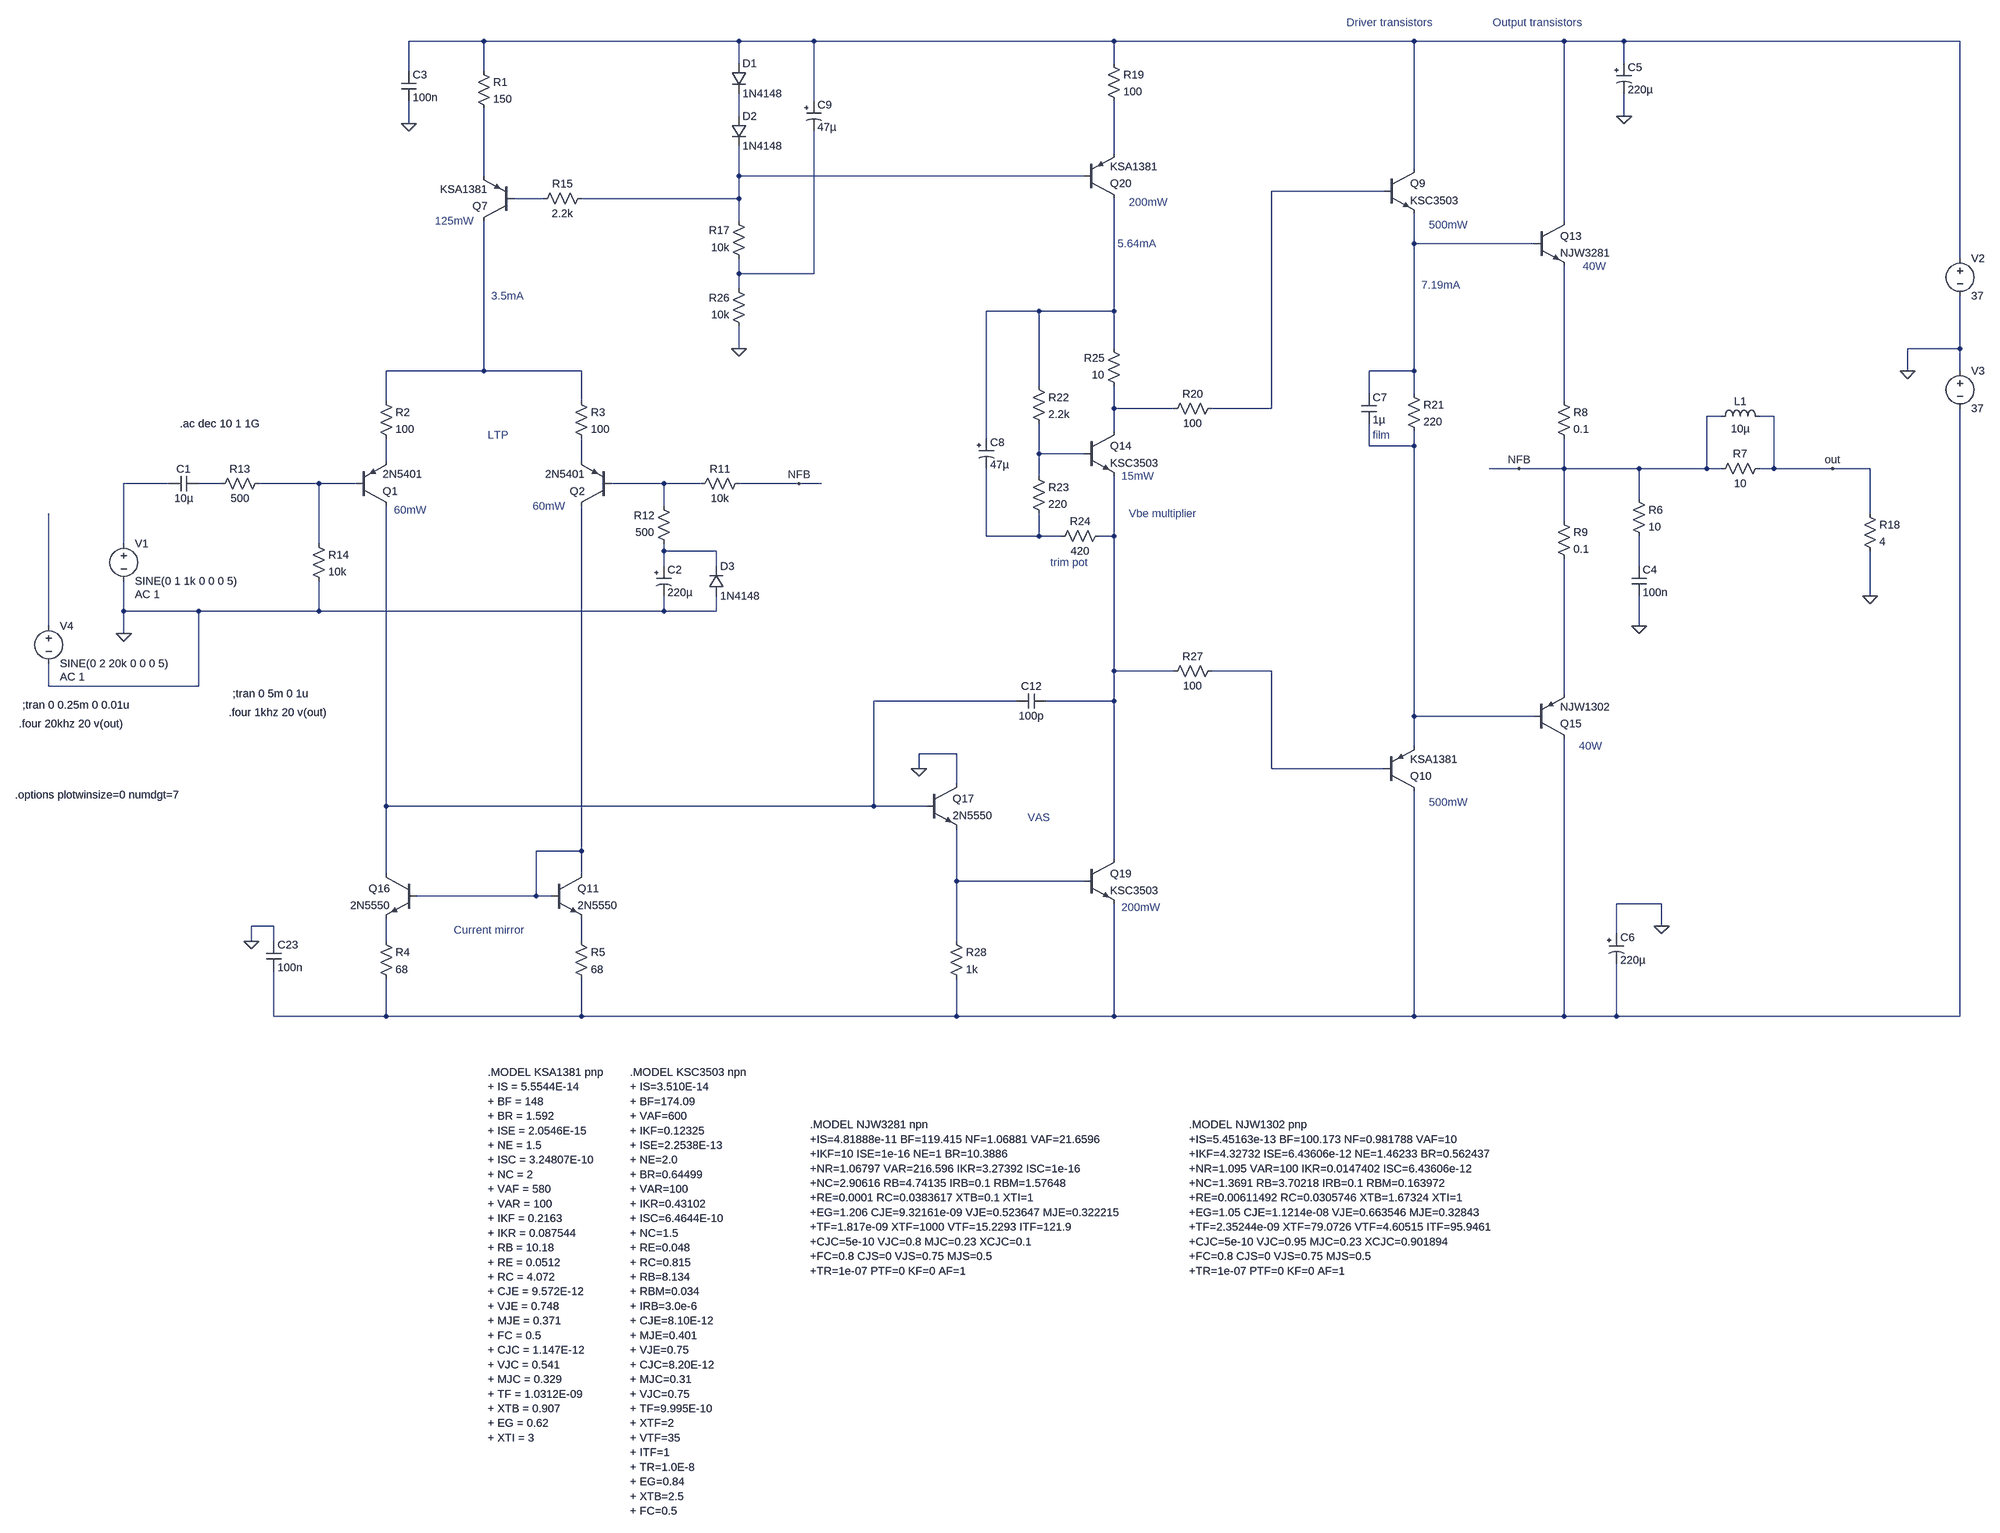
[diagram p0: schematic blameless-v1.asc]
blameless-v1.asc, the LTspice schematic file:
Version 4
SHEET 1 3556 2568
WIRE -32 -832 -192 -832
WIRE 512 -832 -32 -832
WIRE 672 -832 512 -832
WIRE 1312 -832 672 -832
WIRE 1952 -832 1312 -832
WIRE 2272 -832 1952 -832
WIRE 2400 -832 2272 -832
WIRE 3120 -832 2400 -832
WIRE 512 -784 512 -832
WIRE 1312 -784 1312 -832
WIRE 2400 -784 2400 -832
WIRE -192 -768 -192 -832
WIRE -32 -768 -32 -832
WIRE 672 -704 672 -832
WIRE 512 -672 512 -720
WIRE 2400 -672 2400 -720
WIRE -192 -656 -192 -704
WIRE 1312 -592 1312 -704
WIRE 1952 -560 1952 -832
WIRE -32 -544 -32 -688
WIRE 512 -544 512 -608
WIRE 1248 -544 512 -544
WIRE 1888 -512 1648 -512
WIRE 96 -496 32 -496
WIRE 512 -496 512 -544
WIRE 512 -496 176 -496
WIRE 512 -448 512 -496
WIRE 2272 -448 2272 -832
WIRE 1952 -400 1952 -464
WIRE 2208 -400 1952 -400
WIRE 3120 -368 3120 -832
WIRE 512 -336 512 -368
WIRE 672 -336 672 -640
WIRE 672 -336 512 -336
WIRE 512 -304 512 -336
WIRE 1152 -256 1040 -256
WIRE 1312 -256 1312 -496
WIRE 1312 -256 1152 -256
WIRE 512 -176 512 -224
WIRE 1312 -176 1312 -256
WIRE 3120 -176 3120 -288
WIRE 3120 -176 3008 -176
WIRE -32 -128 -32 -448
WIRE -32 -128 -240 -128
WIRE 176 -128 -32 -128
WIRE 1952 -128 1952 -400
WIRE 1952 -128 1856 -128
WIRE 3008 -128 3008 -176
WIRE 3120 -128 3120 -176
WIRE 1152 -96 1152 -256
WIRE 1856 -80 1856 -128
WIRE 1952 -80 1952 -128
WIRE -240 -64 -240 -128
WIRE 176 -64 176 -128
WIRE 2272 -64 2272 -352
WIRE 1312 -48 1312 -96
WIRE 1440 -48 1312 -48
WIRE 1648 -48 1648 -512
WIRE 1648 -48 1520 -48
WIRE 2608 -32 2576 -32
WIRE 2720 -32 2688 -32
WIRE 1312 0 1312 -48
WIRE 1040 16 1040 -256
WIRE 1856 32 1856 -16
WIRE 1952 32 1952 0
WIRE 1952 32 1856 32
WIRE 1152 48 1152 -16
WIRE 1248 48 1152 48
WIRE -240 64 -240 16
WIRE 176 64 176 16
WIRE 2176 80 2112 80
WIRE 2272 80 2272 16
WIRE 2272 80 2176 80
WIRE 2432 80 2272 80
WIRE 2576 80 2576 -32
WIRE 2576 80 2432 80
WIRE 2608 80 2576 80
WIRE 2720 80 2720 -32
WIRE 2720 80 2688 80
WIRE 2848 80 2720 80
WIRE 2928 80 2848 80
WIRE 1152 96 1152 48
WIRE -704 112 -800 112
WIRE -592 112 -640 112
WIRE -384 112 -512 112
WIRE -304 112 -384 112
WIRE 352 112 240 112
WIRE 432 112 352 112
WIRE 640 112 512 112
WIRE 688 112 640 112
WIRE 2432 144 2432 80
WIRE 352 160 352 112
WIRE 2928 176 2928 80
WIRE 2272 192 2272 80
WIRE 1040 224 1040 80
WIRE 1152 224 1152 176
WIRE 1152 224 1040 224
WIRE 1200 224 1152 224
WIRE 1312 224 1312 96
WIRE 1312 224 1280 224
WIRE -800 240 -800 112
WIRE -384 240 -384 112
WIRE 352 256 352 240
WIRE 464 256 352 256
WIRE 352 288 352 256
WIRE 464 288 464 256
WIRE 2432 288 2432 224
WIRE 2928 352 2928 256
WIRE -800 384 -800 320
WIRE -640 384 -800 384
WIRE -384 384 -384 320
WIRE -384 384 -640 384
WIRE 352 384 352 352
WIRE 352 384 -384 384
WIRE 464 384 464 352
WIRE 464 384 352 384
WIRE -960 416 -960 176
WIRE 2432 416 2432 352
WIRE -800 432 -800 384
WIRE 1312 512 1312 224
WIRE 1440 512 1312 512
WIRE 1648 512 1520 512
WIRE -960 544 -960 496
WIRE -640 544 -640 384
WIRE -640 544 -960 544
WIRE 2272 560 2272 272
WIRE 1104 576 800 576
WIRE 1312 576 1312 512
WIRE 1312 576 1168 576
WIRE 1952 608 1952 32
WIRE 2208 608 1952 608
WIRE 1952 672 1952 608
WIRE 976 688 896 688
WIRE 896 720 896 688
WIRE 1648 720 1648 512
WIRE 1888 720 1648 720
WIRE 976 752 976 688
WIRE -240 800 -240 160
WIRE 800 800 800 576
WIRE 800 800 -240 800
WIRE 912 800 800 800
WIRE 176 896 176 160
WIRE 176 896 80 896
WIRE 1312 912 1312 576
WIRE -240 944 -240 800
WIRE 176 944 176 896
WIRE 976 960 976 848
WIRE 1248 960 976 960
WIRE 80 992 80 896
WIRE 80 992 -176 992
WIRE 112 992 80 992
WIRE 2480 1008 2384 1008
WIRE -480 1056 -528 1056
WIRE 2480 1056 2480 1008
WIRE 2384 1072 2384 1008
WIRE -528 1088 -528 1056
WIRE -480 1088 -480 1056
WIRE -240 1088 -240 1040
WIRE 176 1088 176 1040
WIRE 976 1088 976 960
WIRE -480 1248 -480 1152
WIRE -240 1248 -240 1168
WIRE -240 1248 -480 1248
WIRE 176 1248 176 1168
WIRE 176 1248 -240 1248
WIRE 976 1248 976 1168
WIRE 976 1248 176 1248
WIRE 1312 1248 1312 1008
WIRE 1312 1248 976 1248
WIRE 1952 1248 1952 768
WIRE 1952 1248 1312 1248
WIRE 2272 1248 2272 656
WIRE 2272 1248 1952 1248
WIRE 2384 1248 2384 1136
WIRE 2384 1248 2272 1248
WIRE 3120 1248 3120 -48
WIRE 3120 1248 2384 1248
FLAG -800 432 0
FLAG 2928 352 0
FLAG 3008 -128 0
FLAG 2848 80 out
FLAG 2176 80 NFB
FLAG 640 112 NFB
FLAG 896 720 0
FLAG -528 1088 0
FLAG 512 -176 0
FLAG -192 -656 0
FLAG 2432 416 0
FLAG 2400 -672 0
FLAG 2480 1056 0
DATAFLAG 2528 1248 ""
DATAFLAG 1312 416 ""
DATAFLAG 1216 -256 ""
DATAFLAG 2496 80 ""
DATAFLAG 2480 -832 ""
SYMBOL pnp 240 160 R180
SYMATTR InstName Q2
SYMATTR Value 2N5401
SYMBOL pnp -304 160 M180
SYMATTR InstName Q1
SYMATTR Value 2N5401
SYMBOL res -48 -784 R0
SYMATTR InstName R1
SYMATTR Value 150
SYMBOL res -256 -80 R0
SYMATTR InstName R2
SYMATTR Value 100
SYMBOL res 160 -80 R0
SYMATTR InstName R3
SYMATTR Value 100
SYMBOL res -256 1072 R0
SYMATTR InstName R4
SYMATTR Value 68
SYMBOL res 160 1072 R0
SYMATTR InstName R5
SYMATTR Value 68
SYMBOL res 528 96 R90
WINDOW 0 0 56 VBottom 2
WINDOW 3 32 56 VTop 2
SYMATTR InstName R11
SYMATTR Value 10k
SYMBOL res 368 256 R180
WINDOW 0 36 76 Left 2
WINDOW 3 36 40 Left 2
SYMATTR InstName R12
SYMATTR Value 500
SYMBOL res -608 128 R270
WINDOW 0 32 56 VTop 2
WINDOW 3 0 56 VBottom 2
SYMATTR InstName R13
SYMATTR Value 500
SYMBOL res -400 224 R0
SYMATTR InstName R14
SYMATTR Value 10k
SYMBOL res 2912 160 R0
SYMATTR InstName R18
SYMATTR Value 4
SYMBOL cap -640 96 R90
WINDOW 0 0 32 VBottom 2
WINDOW 3 32 32 VTop 2
SYMATTR InstName C1
SYMATTR Value 10µ
SYMBOL voltage -800 224 R0
WINDOW 123 24 124 Left 2
WINDOW 39 0 0 Left 0
SYMATTR Value2 AC 1
SYMATTR InstName V1
SYMATTR Value SINE(0 1 1k 0 0 0 5)
SYMBOL voltage 3120 -384 R0
WINDOW 123 0 0 Left 0
WINDOW 39 24 44 Left 2
SYMATTR InstName V2
SYMATTR Value 37
SYMBOL voltage 3120 -144 R0
WINDOW 123 0 0 Left 0
WINDOW 39 24 44 Left 2
SYMATTR InstName V3
SYMATTR Value 37
SYMBOL npn 1888 -560 R0
SYMATTR InstName Q9
SYMATTR Value KSC3503
SYMBOL npn 2208 -448 R0
SYMATTR InstName Q13
SYMATTR Value NJW3281
SYMBOL pnp 2208 656 M180
SYMATTR InstName Q15
SYMATTR Value NJW1302
SYMBOL pnp 1888 768 M180
SYMATTR InstName Q10
SYMATTR Value KSA1381
SYMBOL res 2256 -80 R0
SYMATTR InstName R8
SYMATTR Value 0.1
SYMBOL res 2256 176 R0
SYMATTR InstName R9
SYMATTR Value 0.1
SYMBOL res 1936 -96 R0
SYMATTR InstName R21
SYMATTR Value 220
SYMBOL npn 1248 0 R0
SYMATTR InstName Q14
SYMATTR Value KSC3503
SYMBOL res 1136 -112 R0
SYMATTR InstName R22
SYMATTR Value 2.2k
SYMBOL res 1136 80 R0
SYMATTR InstName R23
SYMATTR Value 220
SYMBOL res 1296 208 R90
WINDOW 0 0 56 VBottom 2
WINDOW 3 32 56 VTop 2
SYMATTR InstName R24
SYMATTR Value 420
SYMBOL npn 112 944 R0
SYMATTR InstName Q11
SYMATTR Value 2N5550
SYMBOL npn -176 944 M0
SYMATTR InstName Q16
SYMATTR Value 2N5550
SYMBOL npn 912 752 R0
SYMATTR InstName Q17
SYMATTR Value 2N5550
SYMBOL npn 1248 912 R0
SYMATTR InstName Q19
SYMATTR Value KSC3503
SYMBOL res 1296 -800 R0
SYMATTR InstName R19
SYMATTR Value 100
SYMBOL res 960 1072 R0
SYMATTR InstName R28
SYMATTR Value 1k
SYMBOL cap 1840 -80 R0
SYMATTR InstName C7
SYMATTR Value 1µ
SYMATTR SpiceLine V=310 Irms=0 Rser=0.027 Lser=13.6n
SYMBOL polcap 1024 16 R0
WINDOW 3 24 56 Left 2
SYMATTR Value 47µ
SYMATTR InstName C8
SYMATTR Description Capacitor
SYMATTR Type cap
SYMATTR SpiceLine V=35 Irms=190m Rser=0.5 Lser=0
SYMBOL polcap 656 -704 R0
WINDOW 3 24 56 Left 2
SYMATTR Value 47µ
SYMATTR InstName C9
SYMATTR Description Capacitor
SYMATTR Type cap
SYMATTR SpiceLine V=35 Irms=190m Rser=0.5 Lser=0
SYMBOL pnp 1248 -496 M180
SYMATTR InstName Q20
SYMATTR Value KSA1381
SYMBOL cap 1168 592 M270
WINDOW 0 32 32 VTop 2
WINDOW 3 0 32 VBottom 2
SYMATTR InstName C12
SYMATTR Value 100p
SYMBOL res 1328 -80 R180
WINDOW 0 36 76 Left 2
WINDOW 3 36 40 Left 2
SYMATTR InstName R25
SYMATTR Value 10
SYMBOL cap -496 1088 R0
SYMATTR InstName C23
SYMATTR Value 100n
SYMATTR SpiceLine V=25 Irms=2.1 Rser=0.0606238 Lser=0 mfg="KEMET" pn="C1210C104K3RAC" type="X7R"
SYMBOL voltage -960 400 R0
WINDOW 123 24 124 Left 2
WINDOW 39 0 0 Left 0
SYMATTR Value2 AC 1
SYMATTR InstName V4
SYMATTR Value SINE(0 2 20k 0 0 0 5)
SYMBOL pnp 32 -448 R180
SYMATTR InstName Q7
SYMATTR Value KSA1381
SYMBOL res 192 -512 R90
WINDOW 0 0 56 VBottom 2
WINDOW 3 32 56 VTop 2
SYMATTR InstName R15
SYMATTR Value 2.2k
SYMBOL res 528 -352 R180
WINDOW 0 36 76 Left 2
WINDOW 3 36 40 Left 2
SYMATTR InstName R17
SYMATTR Value 10k
SYMBOL res 528 -208 R180
WINDOW 0 36 76 Left 2
WINDOW 3 36 40 Left 2
SYMATTR InstName R26
SYMATTR Value 10k
SYMBOL diode 496 -784 R0
SYMATTR InstName D1
SYMATTR Value 1N4148
SYMBOL diode 496 -672 R0
SYMATTR InstName D2
SYMATTR Value 1N4148
SYMBOL polcap 336 288 R0
WINDOW 3 24 56 Left 2
SYMATTR Value 220µ
SYMATTR InstName C2
SYMATTR Description Capacitor
SYMATTR Type cap
SYMATTR SpiceLine V=35 Irms=190m Rser=0.5 Lser=0
SYMBOL diode 448 352 M180
WINDOW 0 24 64 Left 2
WINDOW 3 24 0 Left 2
SYMATTR InstName D3
SYMATTR Value 1N4148
SYMBOL res 1536 -64 R90
WINDOW 0 0 56 VBottom 2
WINDOW 3 32 56 VTop 2
SYMATTR InstName R20
SYMATTR Value 100
SYMBOL res 1536 496 R90
WINDOW 0 0 56 VBottom 2
WINDOW 3 32 56 VTop 2
SYMATTR InstName R27
SYMATTR Value 100
SYMBOL cap -208 -768 R0
SYMATTR InstName C3
SYMATTR Value 100n
SYMATTR SpiceLine V=25 Irms=2.1 Rser=0.0606238 Lser=0 mfg="KEMET" pn="C1210C104K3RAC" type="X7R"
SYMBOL res 2416 128 R0
SYMATTR InstName R6
SYMATTR Value 10
SYMBOL cap 2416 288 R0
SYMATTR InstName C4
SYMATTR Value 100n
SYMBOL res 2704 64 R90
WINDOW 0 0 56 VBottom 2
WINDOW 3 32 56 VTop 2
SYMATTR InstName R7
SYMATTR Value 10
SYMBOL ind 2592 -16 R270
WINDOW 0 32 56 VTop 2
WINDOW 3 5 56 VBottom 2
SYMATTR InstName L1
SYMATTR Value 10µ
SYMBOL polcap 2384 -784 R0
WINDOW 3 24 56 Left 2
SYMATTR Value 220µ
SYMATTR InstName C5
SYMATTR Description Capacitor
SYMATTR Type cap
SYMATTR SpiceLine V=35 Irms=190m Rser=0.5 Lser=0
SYMBOL polcap 2368 1072 R0
WINDOW 3 24 56 Left 2
SYMATTR Value 220µ
SYMATTR InstName C6
SYMATTR Description Capacitor
SYMATTR Type cap
SYMATTR SpiceLine V=35 Irms=190m Rser=0.5 Lser=0
TEXT -1016 584 Left 2 !;tran 0 0.25m 0 0.01u
TEXT -16 -288 Left 2 ;3.5mA
TEXT -136 -448 Left 2 ;125mW
TEXT 72 160 Left 2 ;60mW
TEXT -1024 624 Left 2 !.four 20khz 20 v(out)
TEXT -24 1424 Left 2 !.MODEL KSA1381 pnp          \n+ IS = 5.5544E-14     \n+ BF = 148                          \n+ BR = 1.592                    \n+ ISE = 2.0546E-15        \n+ NE = 1.5               \n+ ISC = 3.24807E-10\n+ NC = 2                  \n+ VAF = 580\n+ VAR = 100\n+ IKF = 0.2163            \n+ IKR = 0.087544 \n+ RB = 10.18             \n+ RE = 0.0512 \n+ RC = 4.072                \n+ CJE = 9.572E-12\n+ VJE = 0.748  \n+ MJE = 0.371          \n+ FC = 0.5  \n+ CJC = 1.147E-12\n+ VJC = 0.541          \n+ MJC = 0.329\n+ TF = 1.0312E-09\n+ XTB = 0.907\n+ EG = 0.62\n+ XTI = 3
TEXT 280 1424 Left 2 !.MODEL KSC3503 npn\n+ IS=3.510E-14\n+ BF=174.09\n+ VAF=600\n+ IKF=0.12325\n+ ISE=2.2538E-13\n+ NE=2.0\n+ BR=0.64499\n+ VAR=100\n+ IKR=0.43102\n+ ISC=6.4644E-10\n+ NC=1.5\n+ RE=0.048\n+ RC=0.815\n+ RB=8.134\n+ RBM=0.034\n+ IRB=3.0e-6\n+ CJE=8.10E-12\n+ MJE=0.401\n+ VJE=0.75\n+ CJC=8.20E-12\n+ MJC=0.31\n+ VJC=0.75\n+ TF=9.995E-10\n+ XTF=2\n+ VTF=35\n+ ITF=1\n+ TR=1.0E-8\n+ EG=0.84\n+ XTB=2.5\n+ FC=0.5
TEXT -1032 776 Left 2 !.options plotwinsize=0 numdgt=7
TEXT 664 1536 Left 2 !.MODEL NJW3281 npn\n+IS=4.81888e-11 BF=119.415 NF=1.06881 VAF=21.6596\n+IKF=10 ISE=1e-16 NE=1 BR=10.3886\n+NR=1.06797 VAR=216.596 IKR=3.27392 ISC=1e-16\n+NC=2.90616 RB=4.74135 IRB=0.1 RBM=1.57648\n+RE=0.0001 RC=0.0383617 XTB=0.1 XTI=1\n+EG=1.206 CJE=9.32161e-09 VJE=0.523647 MJE=0.322215\n+TF=1.817e-09 XTF=1000 VTF=15.2293 ITF=121.9\n+CJC=5e-10 VJC=0.8 MJC=0.23 XCJC=0.1\n+FC=0.8 CJS=0 VJS=0.75 MJS=0.5\n+TR=1e-07 PTF=0 KF=0 AF=1
TEXT 1472 1536 Left 2 !.MODEL NJW1302 pnp\n+IS=5.45163e-13 BF=100.173 NF=0.981788 VAF=10\n+IKF=4.32732 ISE=6.43606e-12 NE=1.46233 BR=0.562437\n+NR=1.095 VAR=100 IKR=0.0147402 ISC=6.43606e-12\n+NC=1.3691 RB=3.70218 IRB=0.1 RBM=0.163972\n+RE=0.00611492 RC=0.0305746 XTB=1.67324 XTI=1\n+EG=1.05 CJE=1.1214e-08 VJE=0.663546 MJE=0.32843\n+TF=2.35244e-09 XTF=79.0726 VTF=4.60515 ITF=95.9461\n+CJC=5e-10 VJC=0.95 MJC=0.23 XCJC=0.901894\n+FC=0.8 CJS=0 VJS=0.75 MJS=0.5\n+TR=1e-07 PTF=0 KF=0 AF=1
TEXT 1328 96 Left 2 ;15mW
TEXT -680 -16 Left 2 !.ac dec 10 1 1G
TEXT 1984 -440 Left 2 ;500mW
TEXT 1984 792 Left 2 ;500mW
TEXT 2312 -352 Left 2 ;40W
TEXT 2304 672 Left 2 ;40W
TEXT 1320 -400 Left 2 ;5.64mA
TEXT -224 168 Left 2 ;60mW
TEXT 1344 -488 Left 2 ;200mW
TEXT 1328 1016 Left 2 ;200mW
TEXT 1968 -312 Left 2 ;7.19mA
TEXT 1864 8 Left 2 ;film
TEXT 1176 280 Left 2 ;trim pot
TEXT -24 8 Left 2 ;LTP
TEXT -96 1064 Left 2 ;Current mirror
TEXT 1808 -872 Left 2 ;Driver transistors
TEXT 2120 -872 Left 2 ;Output transistors
TEXT 1344 176 Left 2 ;Vbe multiplier
TEXT -568 560 Left 2 !;tran 0 5m 0 1u
TEXT -576 600 Left 2 !.four 1khz 20 v(out)
TEXT 1128 824 Left 2 ;VAS

The netlist it stands for:
* blameless-v1.asc
Q2 N030 N021 N017 0 2N5401
Q1 N029 N020 N016 0 2N5401
R1 N001 N004 150
R2 N011 N016 100
R3 N011 N017 100
R4 N032 N034 68
R5 N033 N034 68
R11 NFB N021 10k
R12 N024 N021 500
R13 N019 N020 500
R14 N020 0 10k
R18 out 0 4
C1 N019 N018 10µ
V1 N018 0 SINE(0 1 1k 0 0 0 5) AC 1
V2 N001 0 37
V3 0 N034 37
Q9 N001 N006 N008 0 KSC3503
Q13 N001 N008 N012 0 NJW3281
Q15 N034 N014 N028 0 NJW1302
Q10 N034 N027 N014 0 KSA1381
R8 N012 NFB 0.1
R9 NFB N028 0.1
R21 N008 N014 220
Q14 N013 N015 N023 0 KSC3503
R22 N010 N015 2.2k
R23 N015 N022 220
R24 N023 N022 420
Q11 N030 N030 N033 0 2N5550
Q16 N029 N030 N032 0 2N5550
Q17 0 N029 N031 0 2N5550
Q19 N023 N031 N034 0 KSC3503
R19 N001 N003 100
R28 N031 N034 1k
C7 N008 N014 1µ V=310 Irms=0 Rser=0.027 Lser=13.6n
C8 N010 N022 47µ V=35 Irms=190m Rser=0.5 Lser=0
C9 N001 N009 47µ V=35 Irms=190m Rser=0.5 Lser=0
Q20 N010 N005 N003 0 KSA1381
C12 N023 N029 100p
R25 N013 N010 10
C23 0 N034 100n V=25 Irms=2.1 Rser=0.0606238 Lser=0 mfg="KEMET" pn="C1210C104K3RAC" type="X7R"
V4 N026 0 SINE(0 2 20k 0 0 0 5) AC 1
Q7 N011 N007 N004 0 KSA1381
R15 N005 N007 2.2k
R17 N009 N005 10k
R26 0 N009 10k
D1 N001 N002 1N4148
D2 N002 N005 1N4148
C2 N024 0 220µ V=35 Irms=190m Rser=0.5 Lser=0
D3 0 N024 1N4148
R20 N006 N013 100
R27 N027 N023 100
C3 N001 0 100n V=25 Irms=2.1 Rser=0.0606238 Lser=0 mfg="KEMET" pn="C1210C104K3RAC" type="X7R"
R6 NFB N025 10
C4 N025 0 100n
R7 out NFB 10
L1 NFB out 10µ
C5 N001 0 220µ V=35 Irms=190m Rser=0.5 Lser=0
C6 0 N034 220µ V=35 Irms=190m Rser=0.5 Lser=0
.model D D
.lib standard.dio
.model NPN NPN
.model PNP PNP
.lib standard.bjt
;tran 0 0.25m 0 0.01u
* 3.5mA
* 125mW
* 60mW
.four 20khz 20 v(out)
.MODEL KSA1381 pnp
+ IS = 5.5544E-14
+ BF = 148
+ BR = 1.592
+ ISE = 2.0546E-15
+ NE = 1.5
+ ISC = 3.24807E-10
+ NC = 2
+ VAF = 580
+ VAR = 100
+ IKF = 0.2163
+ IKR = 0.087544
+ RB = 10.18
+ RE = 0.0512
+ RC = 4.072
+ CJE = 9.572E-12
+ VJE = 0.748
+ MJE = 0.371
+ FC = 0.5
+ CJC = 1.147E-12
+ VJC = 0.541
+ MJC = 0.329
+ TF = 1.0312E-09
+ XTB = 0.907
+ EG = 0.62
+ XTI = 3
.MODEL KSC3503 npn
+ IS=3.510E-14
+ BF=174.09
+ VAF=600
+ IKF=0.12325
+ ISE=2.2538E-13
+ NE=2.0
+ BR=0.64499
+ VAR=100
+ IKR=0.43102
+ ISC=6.4644E-10
+ NC=1.5
+ RE=0.048
+ RC=0.815
+ RB=8.134
+ RBM=0.034
+ IRB=3.0e-6
+ CJE=8.10E-12
+ MJE=0.401
+ VJE=0.75
+ CJC=8.20E-12
+ MJC=0.31
+ VJC=0.75
+ TF=9.995E-10
+ XTF=2
+ VTF=35
+ ITF=1
+ TR=1.0E-8
+ EG=0.84
+ XTB=2.5
+ FC=0.5
.options plotwinsize=0 numdgt=7
.MODEL NJW3281 npn
+IS=4.81888e-11 BF=119.415 NF=1.06881 VAF=21.6596
+IKF=10 ISE=1e-16 NE=1 BR=10.3886
+NR=1.06797 VAR=216.596 IKR=3.27392 ISC=1e-16
+NC=2.90616 RB=4.74135 IRB=0.1 RBM=1.57648
+RE=0.0001 RC=0.0383617 XTB=0.1 XTI=1
+EG=1.206 CJE=9.32161e-09 VJE=0.523647 MJE=0.322215
+TF=1.817e-09 XTF=1000 VTF=15.2293 ITF=121.9
+CJC=5e-10 VJC=0.8 MJC=0.23 XCJC=0.1
+FC=0.8 CJS=0 VJS=0.75 MJS=0.5
+TR=1e-07 PTF=0 KF=0 AF=1
.MODEL NJW1302 pnp
+IS=5.45163e-13 BF=100.173 NF=0.981788 VAF=10
+IKF=4.32732 ISE=6.43606e-12 NE=1.46233 BR=0.562437
+NR=1.095 VAR=100 IKR=0.0147402 ISC=6.43606e-12
+NC=1.3691 RB=3.70218 IRB=0.1 RBM=0.163972
+RE=0.00611492 RC=0.0305746 XTB=1.67324 XTI=1
+EG=1.05 CJE=1.1214e-08 VJE=0.663546 MJE=0.32843
+TF=2.35244e-09 XTF=79.0726 VTF=4.60515 ITF=95.9461
+CJC=5e-10 VJC=0.95 MJC=0.23 XCJC=0.901894
+FC=0.8 CJS=0 VJS=0.75 MJS=0.5
+TR=1e-07 PTF=0 KF=0 AF=1
* 15mW
.ac dec 10 1 1G
* 500mW
* 500mW
* 40W
* 40W
* 5.64mA
* 60mW
* 200mW
* 200mW
* 7.19mA
* film
* trim pot
* LTP
* Current mirror
* Driver transistors
* Output transistors
* Vbe multiplier
;tran 0 5m 0 1u
.four 1khz 20 v(out)
* VAS
.backanno
.end